# EAGLE design ESP_Uart-V2 (EAGLE 9.6.2)
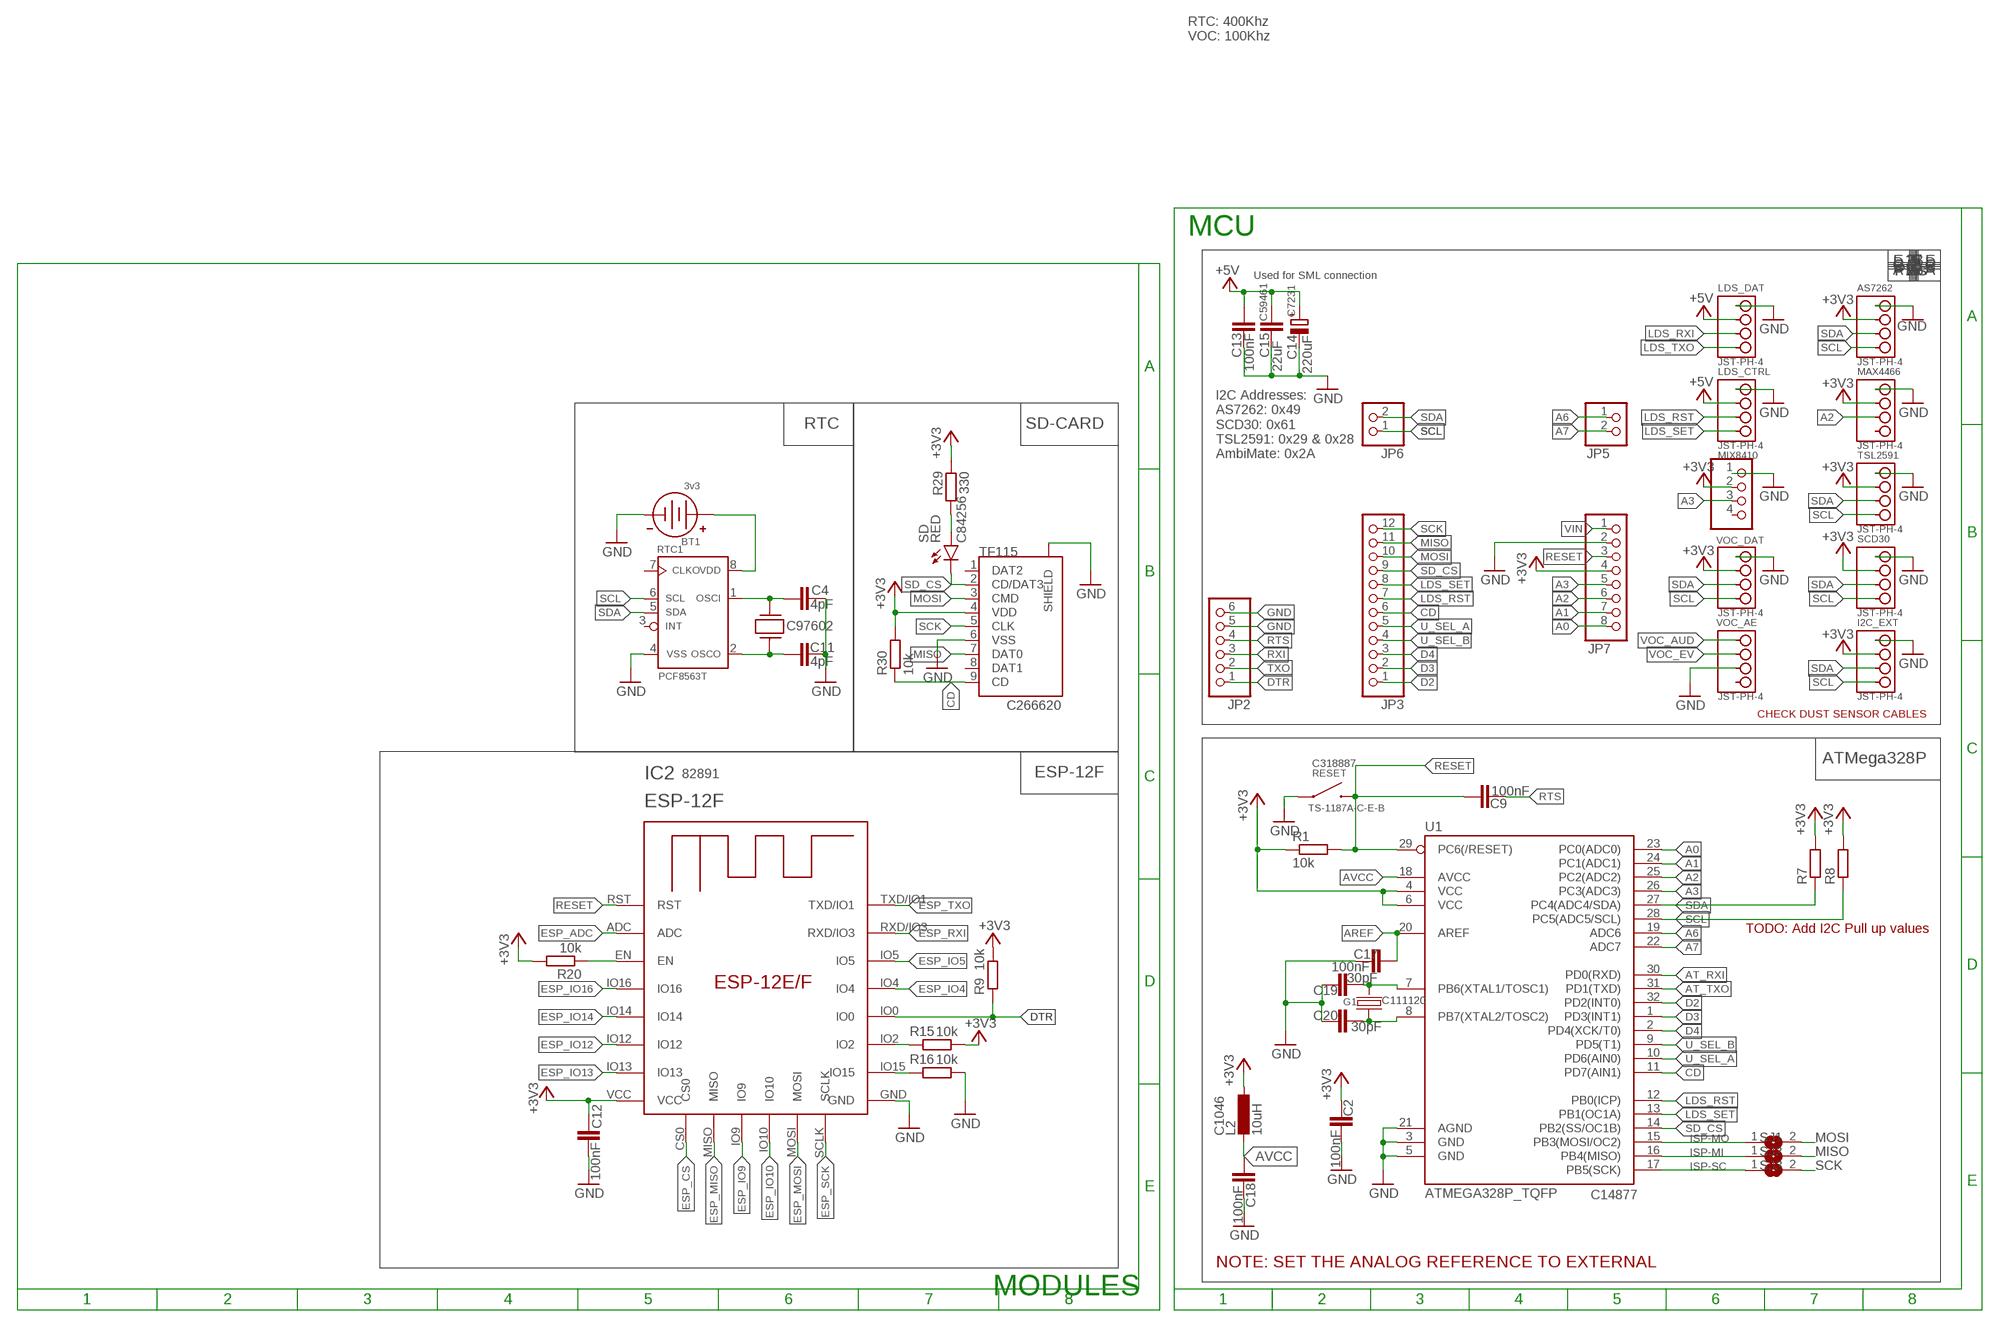
[diagram p0: schematic, sheet 1, part 1 of 2]
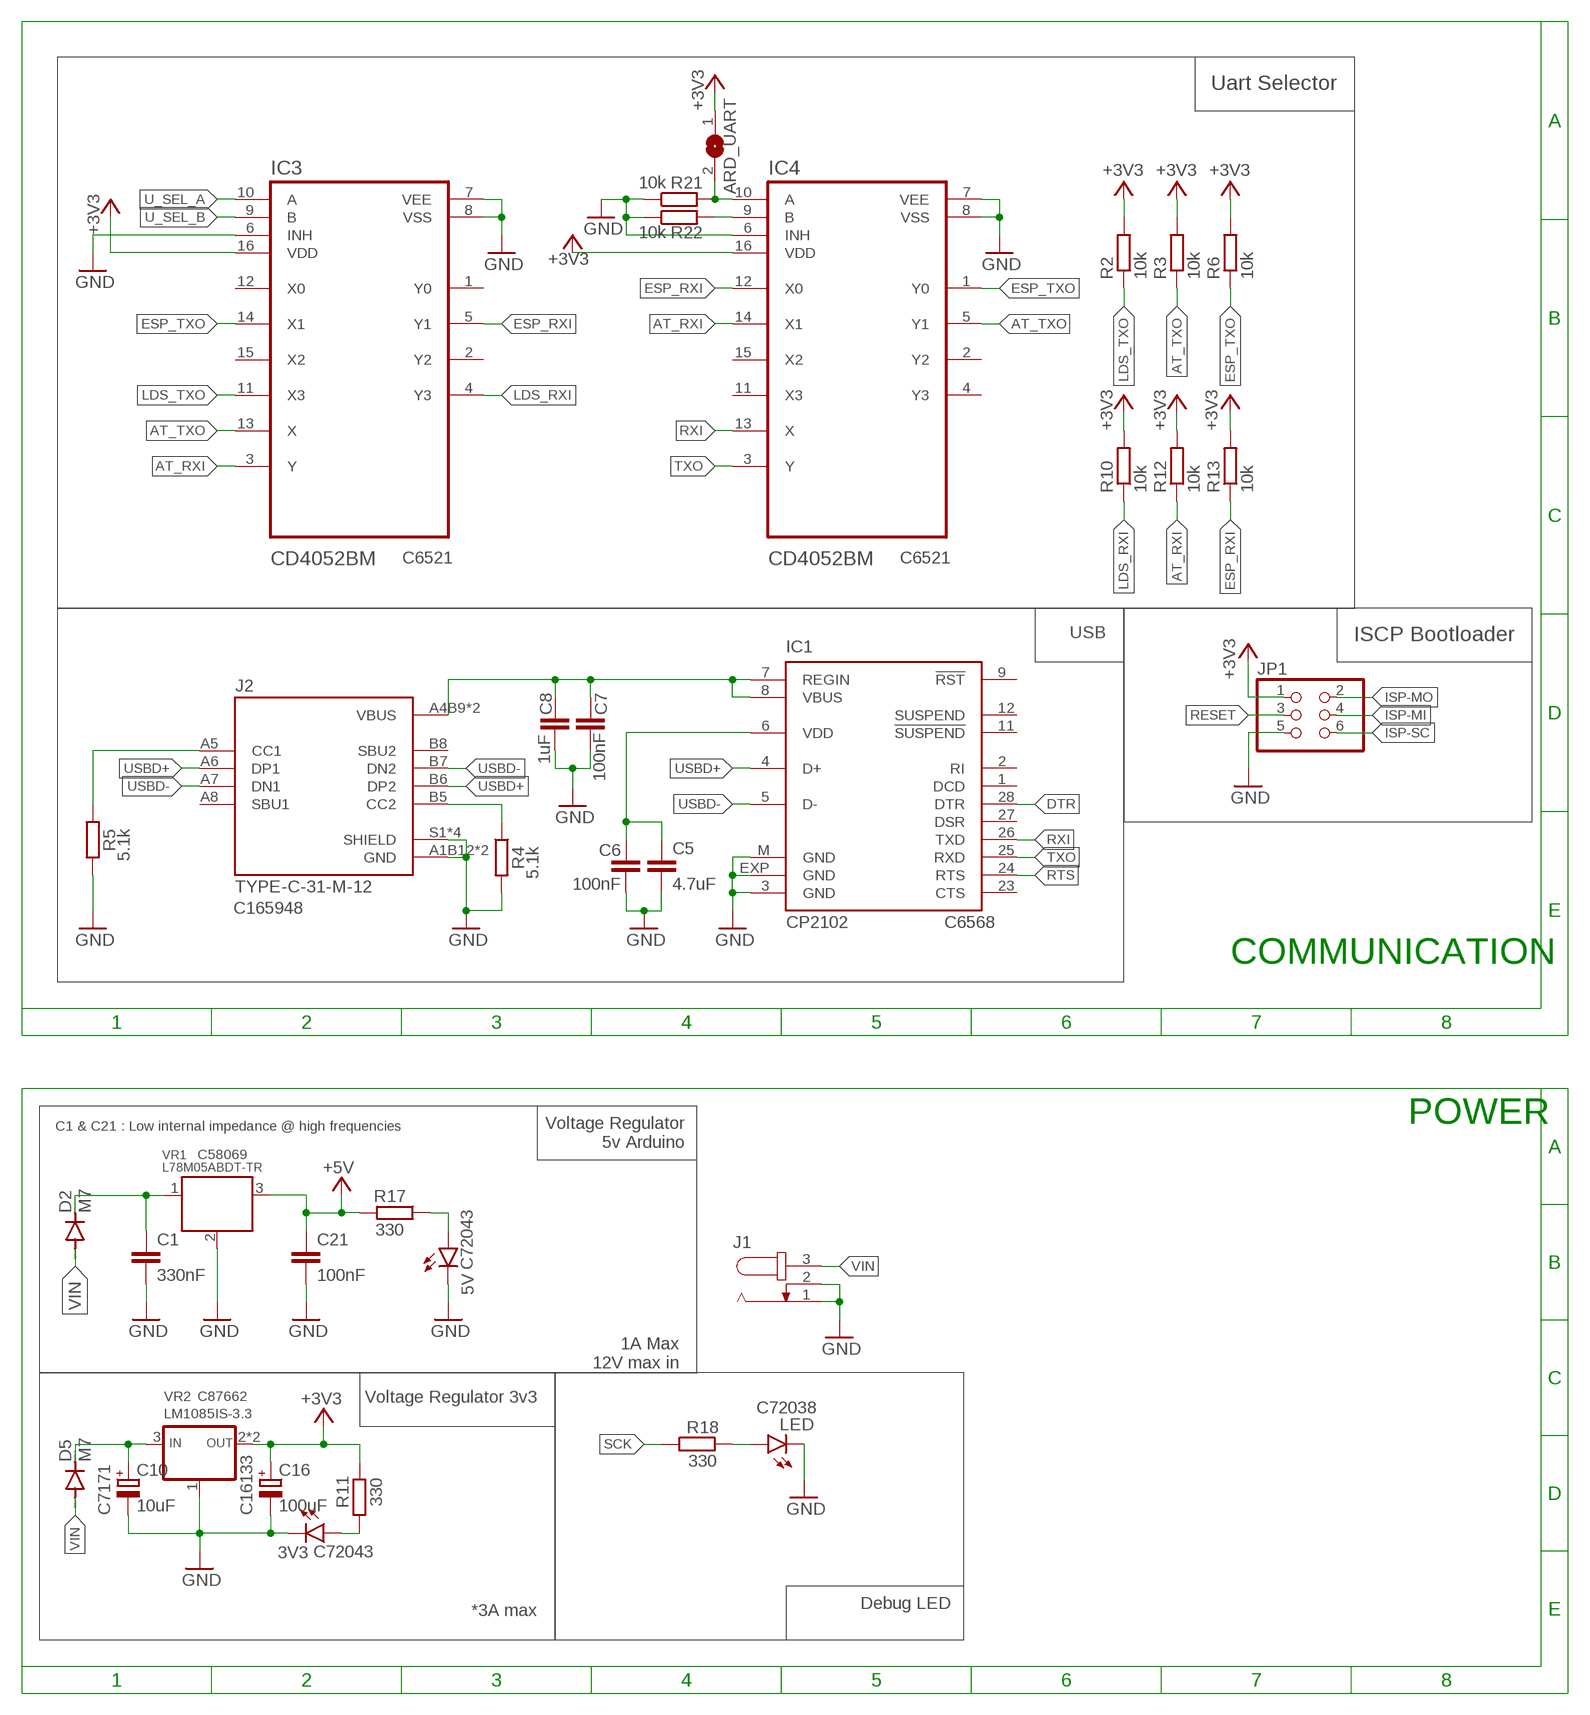
[diagram p1: schematic, sheet 1, part 2 of 2]

## Parts
3V3  C72043  LEDCHIPLED_0603  [CHIPLED_0603]
5V  C72043  LEDCHIPLED_0603  [CHIPLED_0603]
ARD_UART  SJ  [SJ]
AS7262  JST-PH-4  [JST-PH-4]
BT1  3v3  CH29-2032LF  [CH29-2032LF]
C1  330nF  C-EUC0805  [C0805]
C2  100nF  C-EUC0402  [C0402]
C4  4pF  C-EUC0402  [C0402]
C5  4.7uF  C-EUC0402  [C0402]
C6  100nF  C-EUC0402  [C0402]
C7  100nF  C-EUC0402  [C0402]
C8  1uF  C-EUC0402  [C0402]
C9  100nF  C-EUC0402  [C0402]
C10  10uF  CPOL-EUA/3216-18R  [A/3216-18R]
C11  4pF  C-EUC0402  [C0402]
C12  100nF  C-EUC0402  [C0402]
C13  100nF  C-EUC0402  [C0402]
C14  220uF  CPOL-EUA/3216-18R  [A/3216-18R]
C15  22uF  C-EUC0603  [C0603]
C16  100uF  CPOL-EUB/3528-21W  [B/3528-21W]
C17  100nF  C-EUC0402  [C0402]
C18  100nF  C-EUC0402  [C0402]
C19  30pF  C-EUC0402  [C0402]
C20  30pF  C-EUC0402  [C0402]
C21  100nF  C-EUC0402  [C0402]
D2  M7  M7DO-214AC  [DO-214AC]
D5  M7  M7DO-214AC  [DO-214AC]
G1  8Mhz  7A08000008  [7A08000008]
G2  32.768KHZ  [32.768KHZ]
I2C_EXT  JST-PH-4  [JST-PH-4]
IC1  CP2102  [MLP28]
IC2  ESP-12F  [ESP-12E]
IC3  CD4052BM  [SOIC127P600X175-16N]
IC4  CD4052BM  [SOIC127P600X175-16N]
J1  JACK-PLUG1  [SPC4078]
J2  TYPE-C-31-M-12  [HRO_TYPE-C-31-M-12]
JP1  PINHD-2X3  [2X03]
JP2  PINHD-1X6/90  [1X06/90]
JP3  PINHD-1X12  [1X12]
JP5  PINHD-1X2/90  [1X02/90]
JP6  PINHD-1X2/90  [1X02/90]
JP7  PINHD-1X8  [1X08]
L2  10uH  L-EUL2012C  [L2012C]
LDS_CTRL  JST-PH-4  [JST-PH-4]
LDS_DAT  JST-PH-4  [JST-PH-4]
LED  YELLOW  LEDCHIPLED_0603  [CHIPLED_0603]
MAX4466  JST-PH-4  [JST-PH-4]
MIX8410  PINHD-1X4  [1X04]
R1  10k  R-EU_R0402  [R0402]
R2  10k  R-EU_R0402  [R0402]
R3  10k  R-EU_R0402  [R0402]
R4  5.1k  R-EU_R0402  [R0402]
R5  5.1k  R-EU_R0402  [R0402]
R6  10k  R-EU_R0402  [R0402]
R7  R-EU_R0402  [R0402]
R8  R-EU_R0402  [R0402]
R9  10k  R-EU_R0402  [R0402]
R10  10k  R-EU_R0402  [R0402]
R11  330  R-EU_M0805  [M0805]
R12  10k  R-EU_R0402  [R0402]
R13  10k  R-EU_R0402  [R0402]
R15  10k  R-EU_R0402  [R0402]
R16  10k  R-EU_R0402  [R0402]
R17  330  R-EU_M0805  [M0805]
R18  330  R-EU_M0805  [M0805]
R20  10k  R-EU_R0402  [R0402]
R21  10k  R-EU_R0402  [R0402]
R22  10k  R-EU_R0402  [R0402]
R29  330  R-EU_R0402  [R0402]
R30  10k  R-EU_R0402  [R0402]
RESET  TS-1187A-C-E-B  [TS-1187A-C-E-B]
RTC1  PCF8563T  [SOIC8]
SCD30  JST-PH-4  [JST-PH-4]
SD  RED  LEDCHIPLED_0805  [CHIPLED_0805]
SJ1  SJ  [SJ]
SJ2  SJ  [SJ]
SJ3  SJ  [SJ]
TF115  TF-115  [TF-115]
TSL2591  JST-PH-4  [JST-PH-4]
U1  ATMEGA328P_TQFP  [TQFP32-08]
VOC_AE  JST-PH-4  [JST-PH-4]
VOC_DAT  JST-PH-4  [JST-PH-4]
VR1  L78M05ABDT-TR  [DPAK]
VR2  LM1085IS-3.3  [TO263-3]

## Nets
+3V3: ARD_UART.1 AS7262.P2 C2.2 C12.1 C16.+ I2C_EXT.P2 IC2.VCC IC3.16(VDD) IC4.16(VDD) JP1.1 JP7.4 L2.1 MAX4466.P2 MIX8410.2 R1.1 R2.2 R3.2 R6.2 R7.2 R8.2 R9.1 R10.2 R11.2 R12.2 R13.2 R15.1 R20.2 R29.2 R30.2 SCD30.P2 TF115.4(VDD) TSL2591.P2 U1.4(VCC) U1.6(VCC) VOC_DAT.P2 VR2.2(OUT) VR2.TAB(OUT)
+5V: C13.1 C14.+ C15.1 C21.1 LDS_CTRL.P2 LDS_DAT.P2 R17.2 VR1.3(VO)
A0: JP7.8 U1.23(PC0(ADC0))
A1: JP7.7 U1.24(PC1(ADC1))
A2: JP7.6 MAX4466.P3 U1.25(PC2(ADC2))
A3: JP7.5 MIX8410.3 U1.26(PC3(ADC3))
A6: JP5.1 U1.19(ADC6)
A7: JP5.2 U1.22(ADC7)
AREF: C17.1 U1.20(AREF)
AT_RXI: IC3.3(Y) IC4.14(X1) R12.1 U1.30(PD0(RXD))
AT_TXO: IC3.13(X) IC4.5(Y1) R3.1 U1.31(PD1(TXD))
AVCC: C18.2 L2.2 U1.18(AVCC)
CD: JP3.6 R30.1 TF115.9(CD) U1.11(PD7(AIN1))
D2: JP3.1 U1.32(PD2(INT0))
D3: JP3.2 U1.1(PD3(INT1))
D4: JP3.3 U1.2(PD4(XCK/T0))
DTR: IC1.28(DTR) IC2.IO0 JP2.1 R9.2
ESP_ADC: IC2.ADC
ESP_CS: IC2.CS0
ESP_EN: IC2.EN R20.1
ESP_IO4: IC2.IO4
ESP_IO5: IC2.IO5
ESP_IO9: IC2.IO9
ESP_IO10: IC2.IO10
ESP_IO12: IC2.IO12
ESP_IO13: IC2.IO13
ESP_IO14: IC2.IO14
ESP_IO16: IC2.IO16
ESP_MISO: IC2.MISO
ESP_MOSI: IC2.MOSI
ESP_RXI: IC2.RXD/IO3 IC3.5(Y1) IC4.12(X0) R13.1
ESP_SCK: IC2.SCLK
ESP_TXO: IC2.TXD/IO1 IC3.14(X1) IC4.1(Y0) R6.1
GND: 3V3.C 5V.C AS7262.P1 BT1.GND C1.2 C2.1 C4.2 C5.2 C6.2 C7.2 C8.2 C10.- C11.2 C12.2 C13.2 C14.- C15.2 C16.- C17.2 C18.1 C19.2 C20.2 C21.2 I2C_EXT.P1 IC1.3(GND) IC1.EXP(GND) IC1.M(GND) IC2.GND IC3.6(INH) IC3.7(VEE) IC3.8(VSS) IC4.6(INH) IC4.7(VEE) IC4.8(VSS) J1.1 J1.2 J2.A1B12(GND) J2.B1A12(GND) J2.S1(SHIELD) J2.S2(SHIELD) J2.S3(SHIELD) J2.S4(SHIELD) JP1.5 JP2.5 JP2.6 JP7.2 LDS_CTRL.P1 LDS_DAT.P1 LED.C MAX4466.P1 MIX8410.1 R4.2 R5.2 R16.1 R21.1 R22.1 RESET.A RESET.B(A) RTC1.4(VSS) SCD30.P1 TF115.6(VSS) TF115.10(SHIELD) TF115.11(SHIELD) TF115.12(SHIELD) TF115.13(SHIELD) TSL2591.P1 U1.3(GND) U1.5(GND) U1.21(AGND) VOC_AE.P3 VOC_DAT.P1 VR1.2(GND) VR2.1(ADJ)
ISP-MI: JP1.4 SJ2.1 U1.16(PB4(MISO))
ISP-MO: JP1.2 SJ1.1 U1.15(PB3(MOSI/OC2))
ISP-SC: JP1.6 SJ3.1 U1.17(PB5(SCK))
LDS_RST: JP3.7 LDS_CTRL.P3 U1.12(PB0(ICP))
LDS_RXI: IC3.4(Y3) LDS_DAT.P3 R10.1
LDS_SET: JP3.8 LDS_CTRL.P4 U1.13(PB1(OC1A))
LDS_TXO: IC3.11(X3) LDS_DAT.P4 R2.1
MISO: JP3.11 SJ2.2 TF115.7(DAT0)
MOSI: JP3.10 SJ1.2 TF115.3(CMD)
N$1: C4.1 G2.2 RTC1.1(OSCI)
N$2: C19.1 G1.P$1(XT1) U1.7(PB6(XTAL1/TOSC1))
N$3: BT1.VDD BT1.VDD1(VDD) RTC1.8(VDD)
N$4: 3V3.A R11.1
N$5: IC2.IO2 R15.2
N$6: C11.1 G2.1 RTC1.2(OSCO)
N$7: C1.1 D2.C VR1.1(VI)
N$8: LED.A R18.2
N$9: C20.1 G1.P$2(XT2) U1.8(PB7(XTAL2/TOSC2))
N$10: J2.B5(CC2) R4.1
N$11: J2.A5(CC1) R5.1
N$12: ARD_UART.2 IC4.10(A) R21.2
N$13: IC4.9(B) R22.2
N$14: IC2.IO15 R16.2
N$15: 5V.A R17.1
N$16: C5.1 C6.1 IC1.6(VDD)
N$19: C10.+ D5.C VR2.3(IN)
N$20: R29.1 SD.A
RESET: C9.1 IC2.RST JP1.3 JP7.3 R1.2 RESET.C RESET.D(C) U1.29(PC6(/RESET))
RTS: C9.2 IC1.24(RTS) JP2.4
RXI: IC1.26(TXD) IC4.13(X) JP2.3
SCK: JP3.12 R18.1 SJ3.2 TF115.5(CLK)
SCL: AS7262.P4 I2C_EXT.P4 JP6.1 R8.1 RTC1.6(SCL) SCD30.P4 TSL2591.P4 U1.28(PC5(ADC5/SCL)) VOC_DAT.P4
SD_CS: JP3.9 SD.C TF115.2(CD/DAT3) U1.14(PB2(SS/OC1B))
SDA: AS7262.P3 I2C_EXT.P3 JP6.2 R7.1 RTC1.5(SDA) SCD30.P3 TSL2591.P3 U1.27(PC4(ADC4/SDA)) VOC_DAT.P3
TXO: IC1.25(RXD) IC4.3(Y) JP2.2
U_SEL_A: IC3.10(A) JP3.5 U1.10(PD6(AIN0))
U_SEL_B: IC3.9(B) JP3.4 U1.9(PD5(T1))
USBD+: IC1.4(D+) J2.A6(DP1) J2.B6(DP2)
USBD-: IC1.5(D-) J2.A7(DN1) J2.B7(DN2)
VIN: D2.A D5.A J1.3 JP7.1
VOC_AUD: VOC_AE.P1
VOC_EV: VOC_AE.P2
XUSB: C7.1 C8.1 IC1.7(REGIN) IC1.8(VBUS) J2.A4B9(VBUS) J2.B4A9(VBUS)
Unconnected: IC1.1(DCD) IC1.2(RI) IC1.9(!RST) IC1.11(!SUSPEND) IC1.12(SUSPEND) IC1.23(CTS) IC1.27(DSR) IC3.1(Y0) IC3.2(Y2) IC3.12(X0) IC3.15(X2) IC4.2(Y2) IC4.4(Y3) IC4.11(X3) IC4.15(X2) J2.A8(SBU1) J2.B8(SBU2) MAX4466.P4 MIX8410.4 RTC1.3(/INT) RTC1.7(CLKO) TF115.1(DAT2) TF115.8(DAT1) VOC_AE.P4

## Notes on the sheet
- RTC: 400Khz
  VOC: 100Khz
- Uart Selector
- MCU
- Pins
- Used for SML connection
- RTC | SD-CARD
- I2C Addresses:
  AS7262: 0x49
  SCD30: 0x61
  TSL2591: 0x29 & 0x28
  AmbiMate: 0x2A
- USB | ISCP Bootloader
- CHECK DUST SENSOR CABLES
- ATMega328P | COMMUNICATION
- ESP-12F
- Voltage Regulator
  5v Arduino
- POWER
- C1 & C21 : Low internal impedance @ high frequencies
- TODO: Add I2C Pull up values
- 1A Max
  12V max in
- Voltage Regulator 3v3
- Debug LED
- *3A max
- NOTE: SET THE ANALOG REFERENCE TO EXTERNAL
- MODULES

## Library data of the parts
3V3 5V = led:LED: LED OSRAM: - CHIPLED LG R971, LG N971, LY N971, LG Q971, LY Q971, LO R971, LY R971 LH N974, LH R974 LS Q976, LO Q976, LY Q976 LO Q996 - Hyper CHIPLED LW Q18S LB Q993, LB Q99A, LB R99A - SideLED LS A670, LO A670, LY A670, LG A670, LP A670 LB A673, LV A673, LT A673, LW A673 LH A674 LY A675 LS A676, LA A676, LO A676, LY A676, LW A676 LS A679, LY A679, LG A679 - Hyper Micro SIDELED® LS Y876, LA Y876, LO Y876, LY Y876 LT Y87S - SmartLED LW L88C, LW L88S LB L89C, LB L89S, LG L890 LS L89K, LO L89K, LY L89K LS L896, LA L896, LO L896, LY L896 - TOPLED LS T670, LO T670, LY T670, LG T670, LP T670 LSG T670, LSP T670, LSY T670, LOP T670, LYG T670 LG T671, LOG T671, LSG T671 LB T673, LV T673, LT T673, LW T673 LH T674 LS T676, LA T676, LO T676, LY T676, LB T676, LH T676, LSB T676, LW T676 LB T67C, LV T67C, LT T67C, LS T67K, LO T67K, LY T67K, LW E67C LS E67B, LA E67B, LO E67B, LY E67B, LB E67C, LV E67C, LT E67C LW T67C LS T679, LY T679, LG T679 LS T770, LO T770, LY T770, LG T770, LP T770 LB T773, LV T773, LT T773, LW T773 LH T774 LS E675, LA E675, LY E675, LS T675 LS T776, LA T776, LO T776, LY T776, LB T776 LHGB T686 LT T68C, LB T68C - Hyper Mini TOPLED® LB M676 - Mini TOPLED Santana® LG M470 LS M47K, LO M47K, LY M47K Source: http://www.osram.convergy.de LUXEON: - LUMILED® LXK2-PW12-R00, LXK2-PW12-S00, LXK2-PW14-U00, LXK2-PW14-V00 LXK2-PM12-R00, LXK2-PM12-S00, LXK2-PM14-U00 LXK2-PE12-Q00, LXK2-PE12-R00, LXK2-PE12-S00, LXK2-PE14-T00, LXK2-PE14-U00 LXK2-PB12-K00, LXK2-PB12-L00, LXK2-PB12-M00, LXK2-PB14-N00, LXK2-PB14-P00, LXK2-PB14-Q00 LXK2-PR12-L00, LXK2-PR12-M00, LXK2-PR14-Q00, LXK2-PR14-R00 LXK2-PD12-Q00, LXK2-PD12-R00, LXK2-PD12-S00 LXK2-PH12-R00, LXK2-PH12-S00 LXK2-PL12-P00, LXK2-PL12-Q00, LXK2-PL12-R00 Source: www.luxeon.com KINGBRIGHT: KA-3528ASYC Source: www.kingbright.com; PTNR: C72043
ARD_UART SJ1-SJ3 = Tilmann:SJ: SMD solder JUMPER
AS7262 I2C_EXT LDS_CTRL LDS_DAT MAX4466 SCD30 TSL2591 VOC_AE VOC_DAT = Tilmann:JST-PH-4: 4 pin PH JST connector Partnr: C50137 Datasheet: Link <https://datasheet.lcsc.com/lcsc/2010211204_BOOMELE-Boom-Precision-Elec-C50137_C50137.pdf>; PTRNR: C50137
BT1 = Tilmann:CH29-2032LF: CH29-203LLF 20mm 3v Battery holder Footprint: PTH Stock: Farnell <https://nl.farnell.com/multicomp/ch29-2032lf/battery-holder-dip-20mm/dp/2064726> Datasheet: Link <https://www.farnell.com/datasheets/1505864.pdf>
C1 C2 C4-C9 C11-C13 C17-C21 = rcl:C-EU: CAPACITOR, European symbol; SPICEPREFIX: C
C10 = rcl:CPOL-EU: POLARIZED CAPACITOR, European symbol; PTRNR: C7171; SPICEPREFIX: C
C14 = rcl:CPOL-EU: POLARIZED CAPACITOR, European symbol; PTRNR: C7231; SPICEPREFIX: C
C15 = rcl:C-EU: CAPACITOR, European symbol; PTRNR: C59461; SPICEPREFIX: C
C16 = rcl:CPOL-EU: POLARIZED CAPACITOR, European symbol; PTRNR: C16133; SPICEPREFIX: C
D2 D5 = Tilmann:M7: DIODE M7 Diode Footprint: SMA Partnr: C95872 Datasheet: Link <https://datasheet.lcsc.com/lcsc/1810311713_MDD%EF%BC%88Microdiode-Electronics%EF%BC%89-M7_C95872.pdf>; PTNR: C95872
G1 = Tilmann:7A08000008: 7A08000008 Crystal resonator Partnr: C111120 Frequency: 8mhz Datasheet: Link <https://datasheet.lcsc.com/lcsc/1811101510_TXC-Corp-7A08000008_C111120.pdf> Note: two 30pf Capacitors needed; PTRNR: C111120
G2 = Tilmann:32.768KHZ: SC-20S Crystal resonator Partnr: C97602 Freq: 32768Hz Datasheet: Link <https://datasheet.lcsc.com/lcsc/1811151451_Seiko-SC-20S,32.768kHz,20PPM,7pF_C97602.pdf> Note: needs two 4pf capacitors; PTRNR: C97602
IC1 = Tilmann:CP210*: Single-Chip USB to UART Bridge USB to UART converter Partnr: C6568 Datasheet: Link <https://datasheet.lcsc.com/lcsc/1811081920_SILICON-LABS-CP2102-GMR_C6568.pdf>; MF: FARNELL; MPN: CP2102-GM; OC_FARNELL: 9282130; OC_NEWARK: 30K5635; PTRNR: C6568
IC2 = Tilmann:ESP-12: ESP-12F SMD wifi module Partnr: C82891 Datasheet: Link <https://docs.ai-thinker.com/_media/esp8266/docs/esp-12f_product_specification_en.pdf> Documentation: Link <https://arduino-esp8266.readthedocs.io/en/3.0.2/>; PTRNR: 82891
IC3 IC4 = Tilmann:CD4052BM: CDE4052BM single 8 channel analog multiplexer / demultiplexer Partnr: C6521 Footprint: SO16 datasheet: Link <https://www.ti.com/lit/ds/symlink/cd4052b.pdf?ts=1634656882290&ref_url=https%253A%252F%252Fwww.ti.com%252Fstore%252Fti%252Fen%252Fp%252Fproduct%252F%253Fp%253DCD4052BM> Check prices <https://pricing.snapeda.com/parts/CD4052BM/Texas%20Instruments/view-part?ref=eda>; AVAILABILITY: In Stock; DESCRIPTION: 20-V, 4:1, 2-channel general-purpose multiplexer 16-SOIC -55 to 125; MF: Texas Instruments; MP: CD4052BM; PACKAGE: SOIC-16 Texas Instruments; PRICE: None; PTNR: C6521; PTRNR: C6521; PURCHASE-URL: https://pricing.snapeda.com/search/part/CD4052BM/?ref=eda
J1 = Tilmann:JACK-PLUG: DC POWER JACK Power Jack, DC, Right Angle, Through Hole, Rated 5A at 16VDC, PC Terminals Distributor: Farnell (www.Farnell.de) Drawing: 84N1161.pdf / 84N1162.pdf Manufacturer: SPC Technology (www.spctechnology.com) Type: SPC4077 / SPC 4078; OC_FARNELL: unknown; OC_NEWARK: unknown
J2 = Tilmann:TYPE-C-31-M-12: TYPE-C-31-M-12 SMD USB-C connector Partnr: C165948 Footprint: TYPE-C-31_L8.94-W7.3 Datasheet: Link <https://datasheet.lcsc.com/lcsc/1811131825_Korean-Hroparts-Elec-TYPE-C-31-M-12_C165948.pdf>; AVAILABILITY: No availability data; DESCRIPTION: USB Connectors 24 Receptacle 1 8.94*7.3mm RoHS; MF: HRO Electronics Co., Ltd.; MP: TYPE-C-31-M-12; PACKAGE: Package; PRICE: None; PTRNR: C165948
JP1 = Tilmann:PINHD-2X3: PIN HEADER
JP2 = Tilmann:PINHD-1X6: PIN HEADER
JP3 = Tilmann:PINHD-1X12: PIN HEADER
JP5 JP6 = Tilmann:PINHD-1X2: PIN HEADER
JP7 = Tilmann:PINHD-1X8: PIN HEADER
L2 = rcl:L-EU: INDUCTOR, European symbol; PRTNR: C1046; SPICEPREFIX: L
LED = led:LED: LED OSRAM: - CHIPLED LG R971, LG N971, LY N971, LG Q971, LY Q971, LO R971, LY R971 LH N974, LH R974 LS Q976, LO Q976, LY Q976 LO Q996 - Hyper CHIPLED LW Q18S LB Q993, LB Q99A, LB R99A - SideLED LS A670, LO A670, LY A670, LG A670, LP A670 LB A673, LV A673, LT A673, LW A673 LH A674 LY A675 LS A676, LA A676, LO A676, LY A676, LW A676 LS A679, LY A679, LG A679 - Hyper Micro SIDELED® LS Y876, LA Y876, LO Y876, LY Y876 LT Y87S - SmartLED LW L88C, LW L88S LB L89C, LB L89S, LG L890 LS L89K, LO L89K, LY L89K LS L896, LA L896, LO L896, LY L896 - TOPLED LS T670, LO T670, LY T670, LG T670, LP T670 LSG T670, LSP T670, LSY T670, LOP T670, LYG T670 LG T671, LOG T671, LSG T671 LB T673, LV T673, LT T673, LW T673 LH T674 LS T676, LA T676, LO T676, LY T676, LB T676, LH T676, LSB T676, LW T676 LB T67C, LV T67C, LT T67C, LS T67K, LO T67K, LY T67K, LW E67C LS E67B, LA E67B, LO E67B, LY E67B, LB E67C, LV E67C, LT E67C LW T67C LS T679, LY T679, LG T679 LS T770, LO T770, LY T770, LG T770, LP T770 LB T773, LV T773, LT T773, LW T773 LH T774 LS E675, LA E675, LY E675, LS T675 LS T776, LA T776, LO T776, LY T776, LB T776 LHGB T686 LT T68C, LB T68C - Hyper Mini TOPLED® LB M676 - Mini TOPLED Santana® LG M470 LS M47K, LO M47K, LY M47K Source: http://www.osram.convergy.de LUXEON: - LUMILED® LXK2-PW12-R00, LXK2-PW12-S00, LXK2-PW14-U00, LXK2-PW14-V00 LXK2-PM12-R00, LXK2-PM12-S00, LXK2-PM14-U00 LXK2-PE12-Q00, LXK2-PE12-R00, LXK2-PE12-S00, LXK2-PE14-T00, LXK2-PE14-U00 LXK2-PB12-K00, LXK2-PB12-L00, LXK2-PB12-M00, LXK2-PB14-N00, LXK2-PB14-P00, LXK2-PB14-Q00 LXK2-PR12-L00, LXK2-PR12-M00, LXK2-PR14-Q00, LXK2-PR14-R00 LXK2-PD12-Q00, LXK2-PD12-R00, LXK2-PD12-S00 LXK2-PH12-R00, LXK2-PH12-S00 LXK2-PL12-P00, LXK2-PL12-Q00, LXK2-PL12-R00 Source: www.luxeon.com KINGBRIGHT: KA-3528ASYC Source: www.kingbright.com; PTRNR: C72038
MIX8410 = Tilmann:PINHD-1X4: PIN HEADER
R1-R13 R15-R18 R20-R22 R29 R30 = rcl:R-EU_: RESISTOR, European symbol; SPICEPREFIX: R
RESET = Tilmann:TS-1187A-C-E-B: TS-1187A-C-E-B SMD Top actuated 50mA @ 12V Round button Partnr: C318887 Footprint: SMD-SW-4_5.1x5.1x2.5 Datasheet: Link <https://datasheet.lcsc.com/lcsc/2002271432_XKB-Connectivity-TS-1187A-C-E-B_C318887.pdf>; PRTNR: C318887
RTC1 = Tilmann:PCF8563: PCF8563 SMD RTC Module I2C, YY-MM-DD-dd HH:MM:SS (24hr) Footprint: SOIC8 Partnr: C7440 Datasheet: Link <https://datasheet.lcsc.com/lcsc/1809141212_NXP-Semicon-PCF8563T-5,518_C7440.pdf>; PTNR: C7440
SD = led:LED: LED OSRAM: - CHIPLED LG R971, LG N971, LY N971, LG Q971, LY Q971, LO R971, LY R971 LH N974, LH R974 LS Q976, LO Q976, LY Q976 LO Q996 - Hyper CHIPLED LW Q18S LB Q993, LB Q99A, LB R99A - SideLED LS A670, LO A670, LY A670, LG A670, LP A670 LB A673, LV A673, LT A673, LW A673 LH A674 LY A675 LS A676, LA A676, LO A676, LY A676, LW A676 LS A679, LY A679, LG A679 - Hyper Micro SIDELED® LS Y876, LA Y876, LO Y876, LY Y876 LT Y87S - SmartLED LW L88C, LW L88S LB L89C, LB L89S, LG L890 LS L89K, LO L89K, LY L89K LS L896, LA L896, LO L896, LY L896 - TOPLED LS T670, LO T670, LY T670, LG T670, LP T670 LSG T670, LSP T670, LSY T670, LOP T670, LYG T670 LG T671, LOG T671, LSG T671 LB T673, LV T673, LT T673, LW T673 LH T674 LS T676, LA T676, LO T676, LY T676, LB T676, LH T676, LSB T676, LW T676 LB T67C, LV T67C, LT T67C, LS T67K, LO T67K, LY T67K, LW E67C LS E67B, LA E67B, LO E67B, LY E67B, LB E67C, LV E67C, LT E67C LW T67C LS T679, LY T679, LG T679 LS T770, LO T770, LY T770, LG T770, LP T770 LB T773, LV T773, LT T773, LW T773 LH T774 LS E675, LA E675, LY E675, LS T675 LS T776, LA T776, LO T776, LY T776, LB T776 LHGB T686 LT T68C, LB T68C - Hyper Mini TOPLED® LB M676 - Mini TOPLED Santana® LG M470 LS M47K, LO M47K, LY M47K Source: http://www.osram.convergy.de LUXEON: - LUMILED® LXK2-PW12-R00, LXK2-PW12-S00, LXK2-PW14-U00, LXK2-PW14-V00 LXK2-PM12-R00, LXK2-PM12-S00, LXK2-PM14-U00 LXK2-PE12-Q00, LXK2-PE12-R00, LXK2-PE12-S00, LXK2-PE14-T00, LXK2-PE14-U00 LXK2-PB12-K00, LXK2-PB12-L00, LXK2-PB12-M00, LXK2-PB14-N00, LXK2-PB14-P00, LXK2-PB14-Q00 LXK2-PR12-L00, LXK2-PR12-M00, LXK2-PR14-Q00, LXK2-PR14-R00 LXK2-PD12-Q00, LXK2-PD12-R00, LXK2-PD12-S00 LXK2-PH12-R00, LXK2-PH12-S00 LXK2-PL12-P00, LXK2-PL12-Q00, LXK2-PL12-R00 Source: www.luxeon.com KINGBRIGHT: KA-3528ASYC Source: www.kingbright.com; PTRNR: C84256
TF115 = Tilmann:TF-115: TF-115 SMD SD card holder Footprint: TF-115 Partnr: C266620 Datasheet: Link <https://datasheet.lcsc.com/lcsc/2105061832_XUNPU-TF-115_C266620.pdf>; PTNR: C266620; PTRNR: C266620
U1 = Tilmann:ATMEGA328P_TQFP: Popular 328P in QFP Storefront component: ATmega328 - TQFP <https://www.sparkfun.com/products/13448> (COM-13448) Datasheet <http://www.sparkfun.com/datasheets/Components/SMD/ATMega328.pdf> Ptrnr: C14877; PROD_ID: IC-09069; PTNR: C14877; PTRNR: C14877
VR1 = Tilmann:L78M05ABDT-TR: L78M05ABDT-TR 5V @ 500mA Max 2V dropout Partnr: C58069 Footprint: DPAK Datasheet: Link <https://datasheet.lcsc.com/lcsc/1811011937_STMicroelectronics-L78M05ABDT-TR_C58069.pdf>; PTRNR: C58069
VR2 = Tilmann:LM1085IS-3.3: LM1085 3v3 @ 3A regulator Max 1.5V drop out Partnr: C87662 Footprint: TO263-3 Datasheet: Link <https://datasheet.lcsc.com/lcsc/1810151518_Texas-Instruments-LM1085IS-3.3-NOPB_C87662.pdf>; PTRNR: C87662

## Board
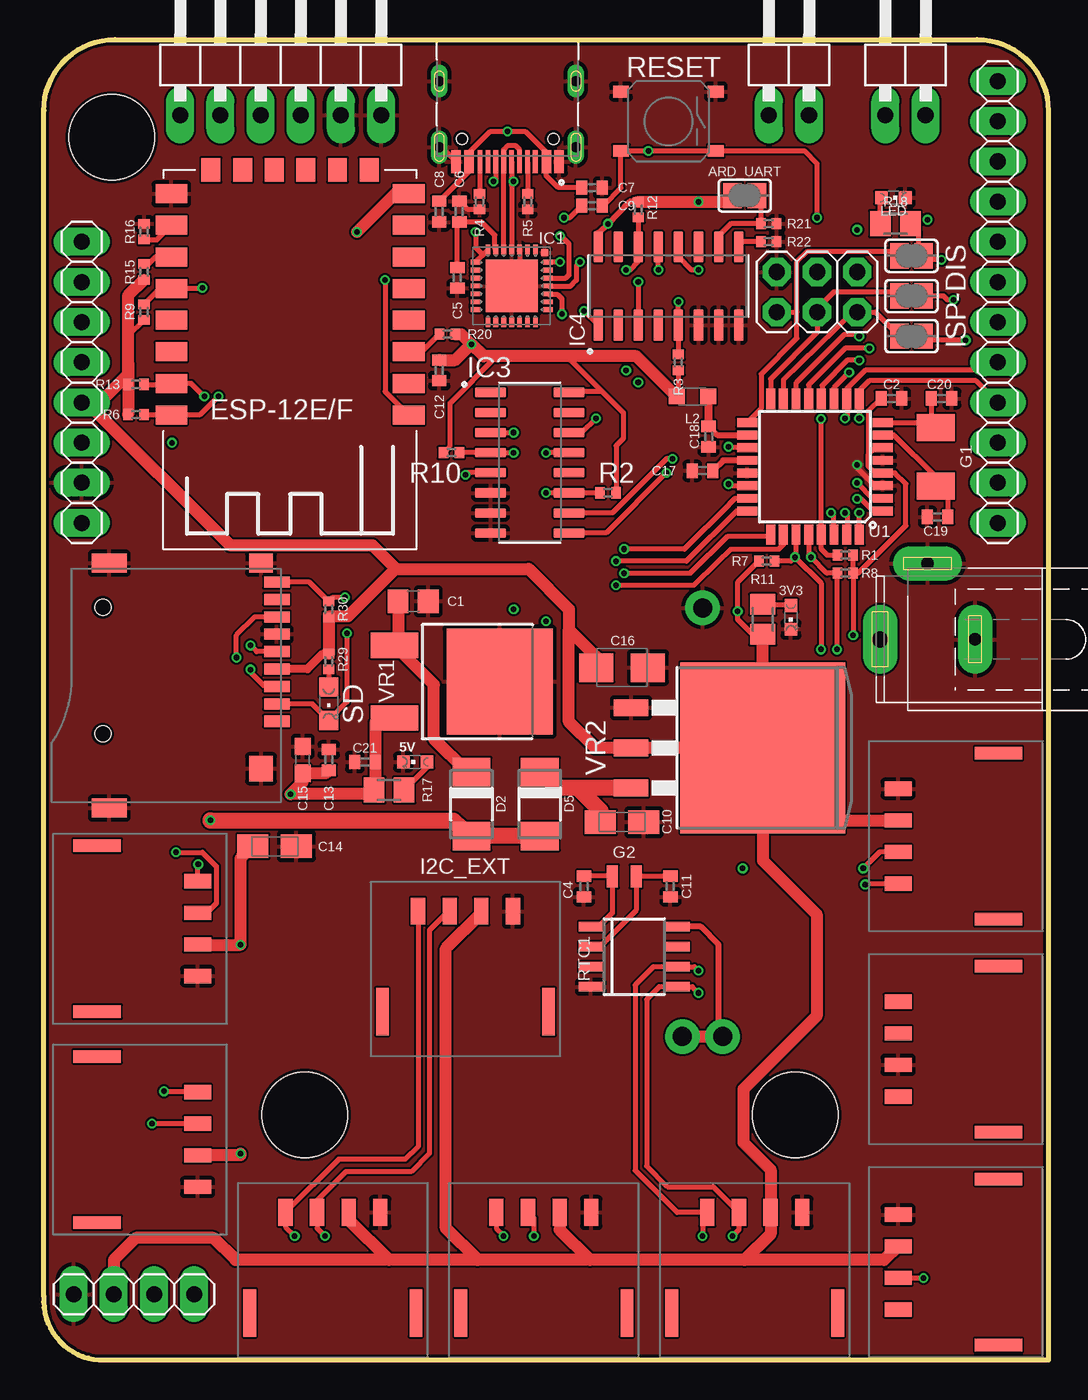
[diagram p2: board, top side]
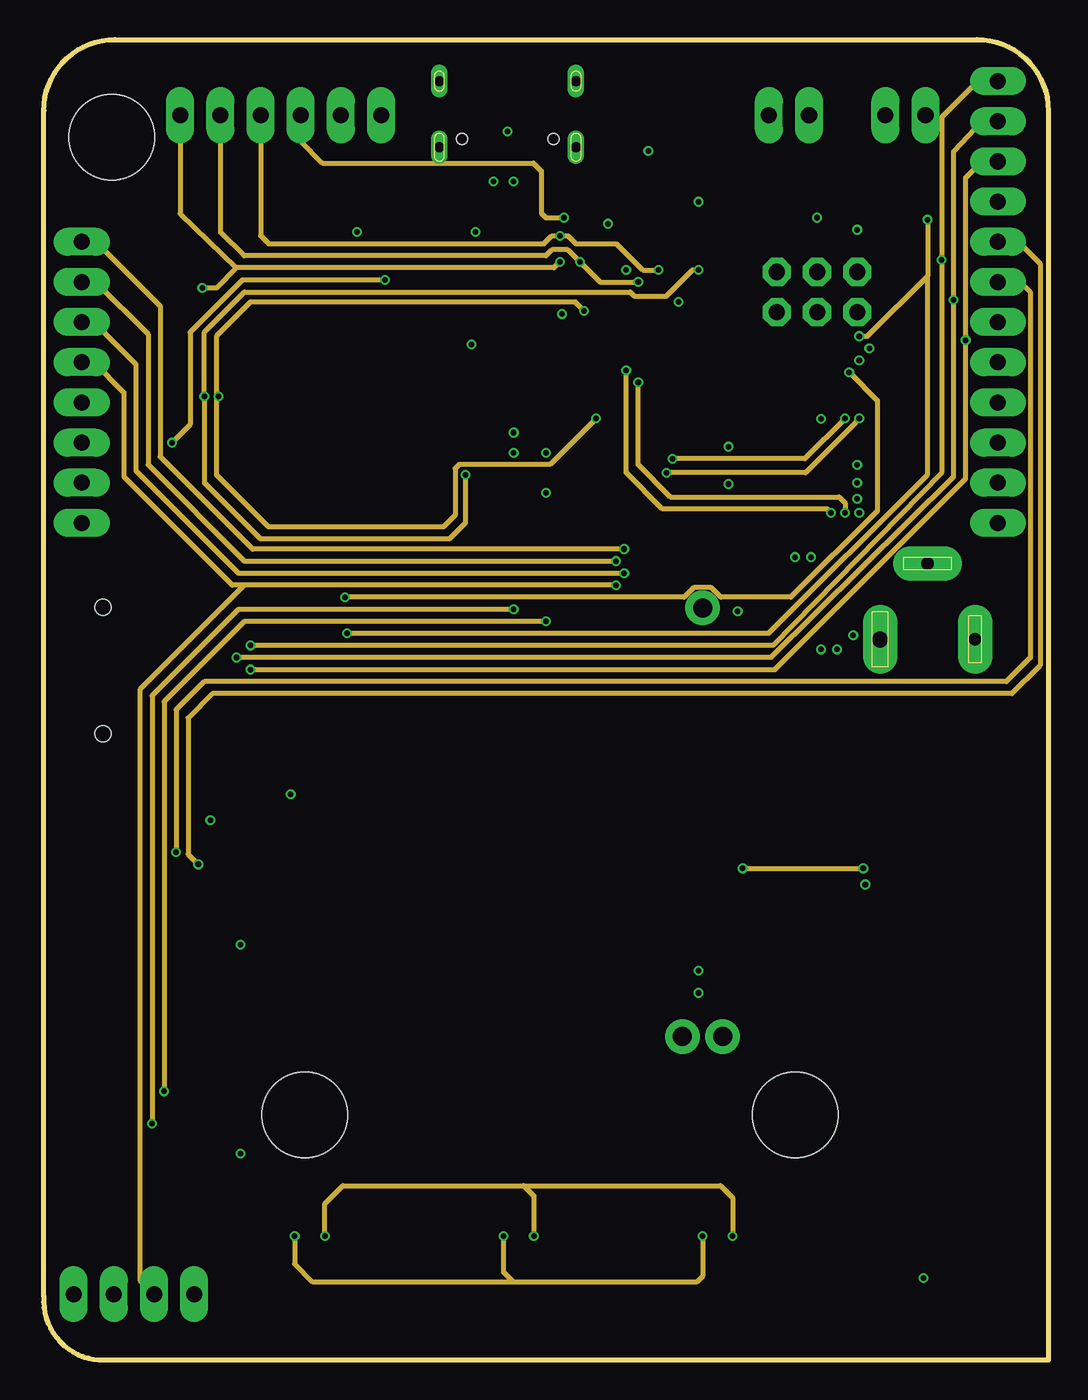
[diagram p3: board, inner layer Route2]
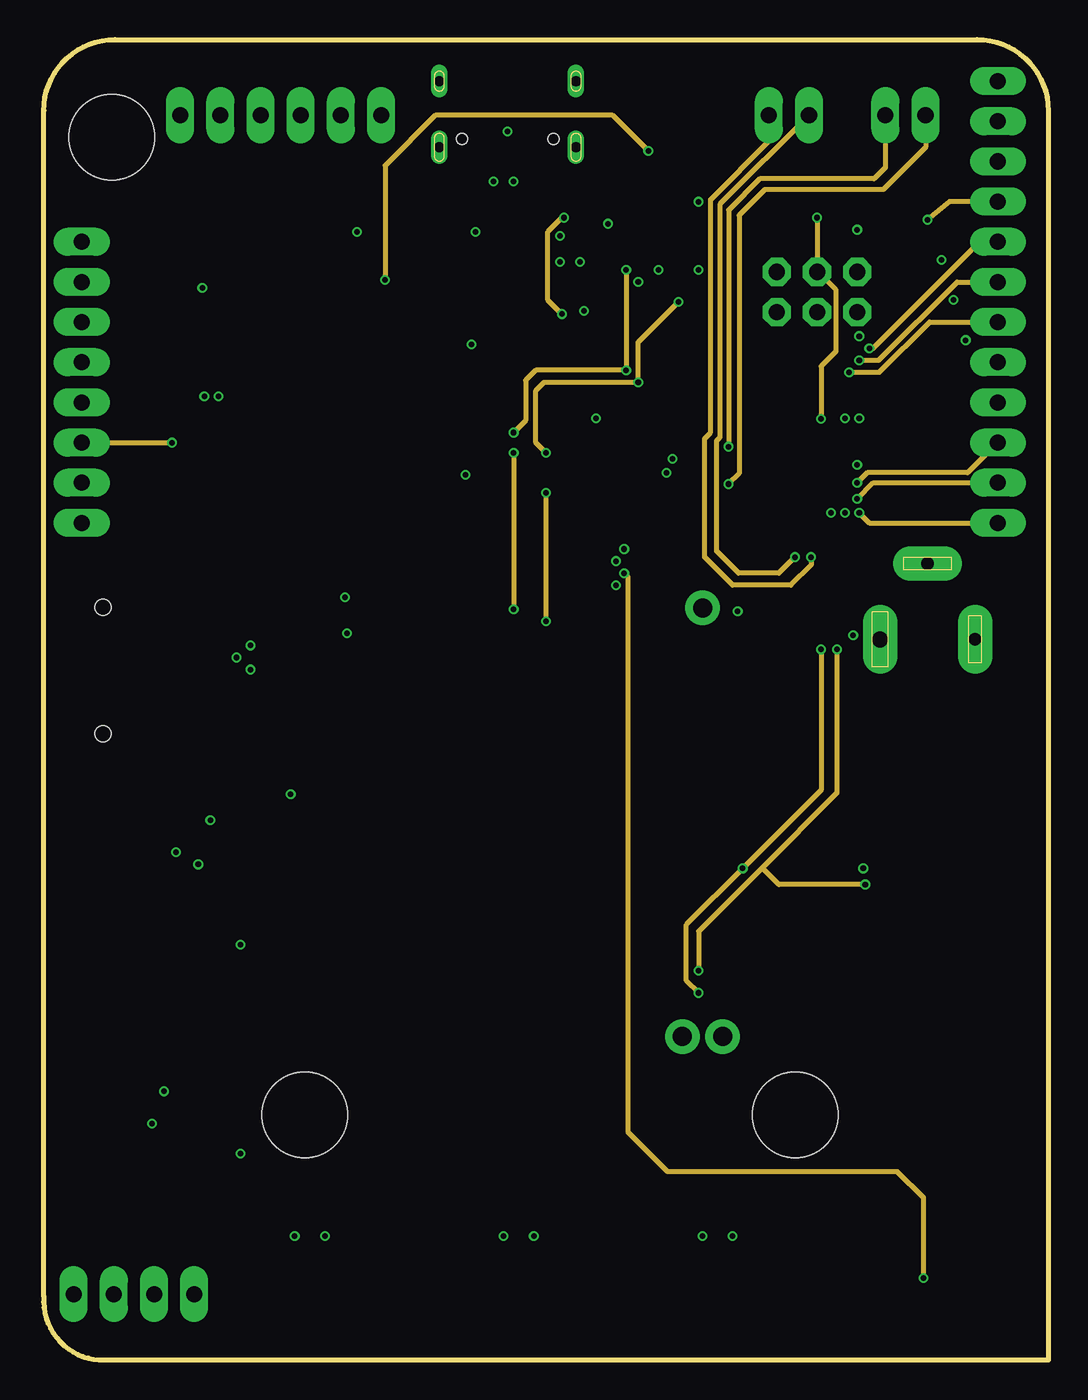
[diagram p4: board, inner layer Route15]
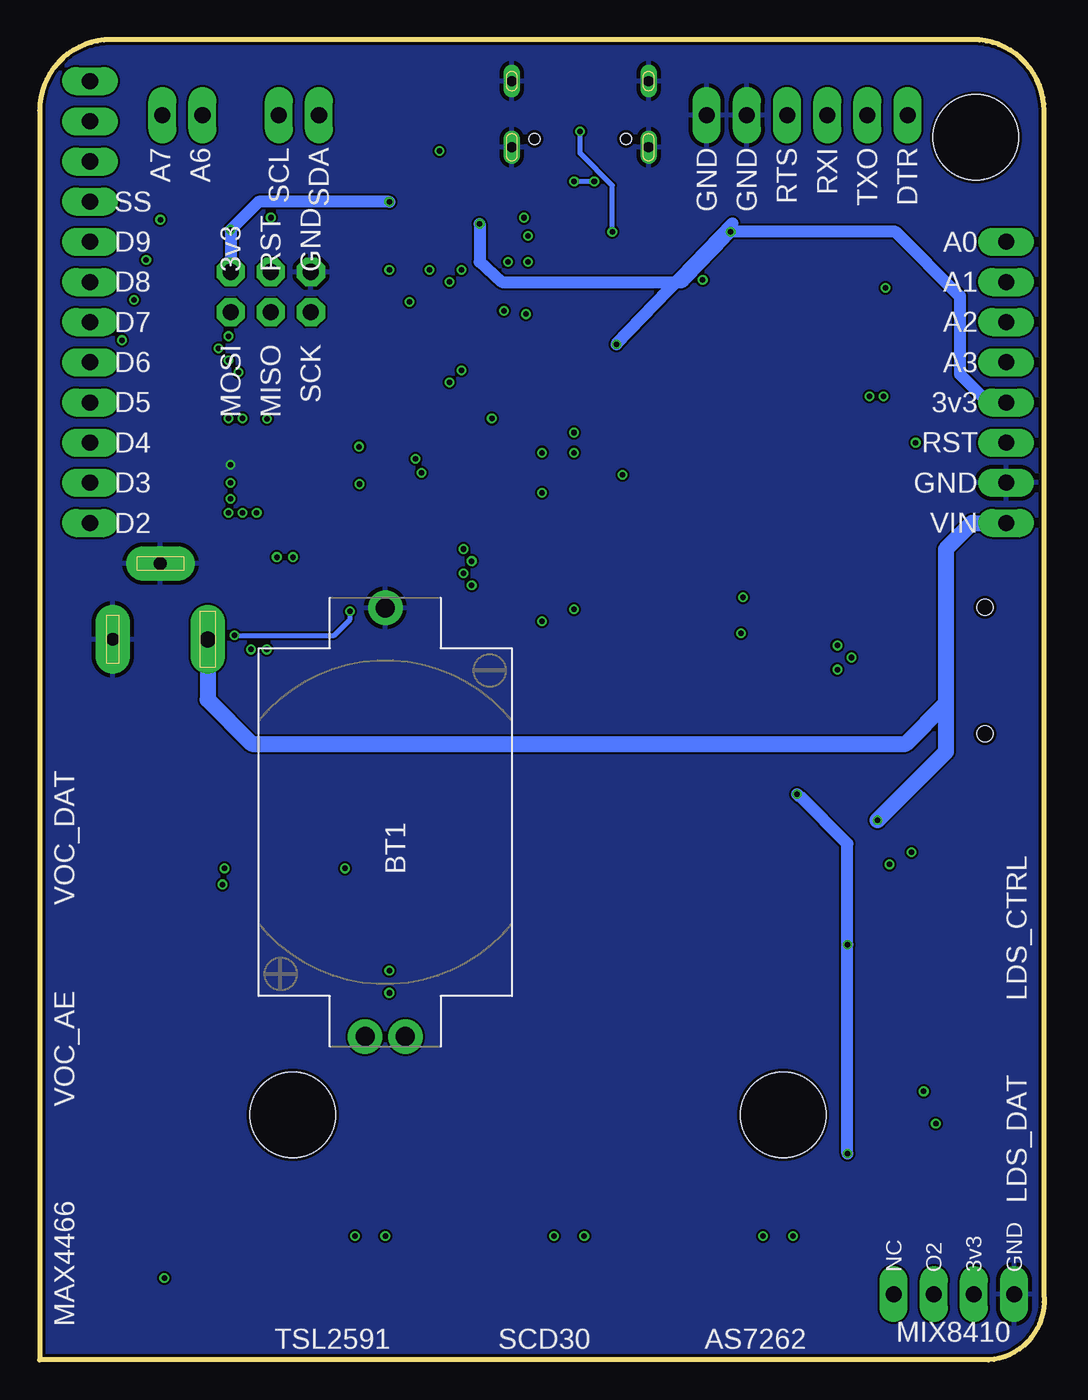
[diagram p5: board, bottom side, seen from below]

Size 63.51 x 83.5 mm. Coordinates in mm from the lower left corner, seen from the top.
Outline: 4.51,83.5 59.01,83.5 arc-90 63.51,79 63.51,0 3.51,0 arc-90 0.01,4 0.01,79 arc-90 4.51,83.5
Copper layers (1+2*15+16): Top 0.035mm / dielectric 0.2mm / Route2 0.0175mm / dielectric 1.065mm / Route15 0.0175mm / dielectric 0.2mm / Bottom 0.035mm
Design rules "jlcpcb-4layers *": minimum track width 5mil, minimum drill 0.2mm, track to track 5mil, track to pad 5mil, pad to pad 5mil, via to via 5mil, smd to smd 5mil, copper to edge 0.2mm, drill to drill 6mil, minimum pad ring 0.15mm, minimum via ring 0.13mm, stop-mask expansion 4mil, vias tented up to drill 0mil, thermal gap 10mil
Holes 5.4 mm at 4.31,77.31 16.51,15.5 47.51,15.5

### Footprints (pad centres in the part's own frame; a part is rotated, then mirrored left to right if it is on the bottom)
CHIPLED_0603 = smd 0.8 x 0.8: A 0,-0.75; C 0,0.75
SJ = smd 1.168 x 1.6: 1 -0.762,0; 2 0.762,0
JST-PH-4 = smd 0.9 x 1.7: P1 -3,-4.15; P2 -1,-4.15; P3 1,-4.15; P4 3,-4.15 | smd 0.8 x 3: SHIELD -5.25,2.2; SHIELD1 5.25,2.2
CH29-2032LF = drill 1.2 pad 2.184: GND -13.55,0; VDD 13.55,-1.27; VDD1 13.55,1.27
C0805 = smd 1.3 x 1.5: 1 -0.95,0; 2 0.95,0
C0402 = smd 0.7 x 0.9: 1 -0.65,0; 2 0.65,0
A/3216-18R = smd 1.95 x 1.5: + 1.375,0; - -1.375,0
C0603 = smd 1.1 x 1: 1 -0.85,0; 2 0.85,0
B/3528-21W = smd 2.15 x 1.8: + 1.625,0; - -1.625,0
DO-214AC = smd 1.8 x 2.4: A 2.025,0; C -2.025,0
7A08000008 = smd 1.7 x 2.4: P$1 -1.85,0; P$2 1.85,0
32.768KHZ = smd 0.7 x 1.4: 1 -0.75,0; 2 0.75,0
MLP28 = smd 0.6 x 0.3: 1 -2.3,1.5; 2 -2.3,1; 3 -2.3,0.5; 4 -2.3,0; 5 -2.3,-0.5; 6 -2.3,-1; 7 -2.3,-1.5; 15 2.3,-1.5; 16 2.3,-1; 17 2.3,-0.5; 18 2.3,0; 19 2.3,0.5; 20 2.3,1; 21 2.3,1.5 | smd 0.3 x 0.6: 8 -1.5,-2.3; 9 -1,-2.3; 10 -0.5,-2.3; 11 0,-2.3; 12 0.5,-2.3; 13 1,-2.3; 14 1.5,-2.3; 22 1.5,2.3; 23 1,2.3; 24 0.5,2.3; 25 0,2.3; 26 -0.5,2.3; 27 -1,2.3; 28 -1.5,2.3 | smd 3.3 x 3.3: EXP 0,0 | smd 0.435 x 0.435: M -2.103,2.103
ESP-12E = smd 2 x 1.2: ADC -7.46,5.53; EN -7.46,3.53; GND 7.54,-6.47; IO0 7.54,-0.47; IO2 7.54,-2.47; IO4 7.54,1.53; IO5 7.54,3.53; IO12 -7.46,-2.47; IO13 -7.46,-4.47; IO14 -7.46,-0.47; IO15 7.54,-4.47; IO16 -7.46,1.53; RST -7.46,7.53; RXD/IO3 7.54,5.53; TXD/IO1 7.54,7.53; VCC -7.46,-6.47 | smd 1.2 x 1.5: CS0 -4.96,-7.97; IO9 -0.96,-7.97; IO10 1.04,-7.97; MISO -2.96,-7.97; MOSI 3.04,-7.97; SCLK 5.04,-7.97
SOIC127P600X175-16N = smd 1.97 x 0.6: 1 -2.475,4.445; 2 -2.475,3.175; 3 -2.475,1.905; 4 -2.475,0.635; 5 -2.475,-0.635; 6 -2.475,-1.905; 7 -2.475,-3.175; 8 -2.475,-4.445; 9 2.475,-4.445; 10 2.475,-3.175; 11 2.475,-1.905; 12 2.475,-0.635; 13 2.475,0.635; 14 2.475,1.905; 15 2.475,3.175; 16 2.475,4.445
SPC4078 = drill 0.8 pad 2.184 long: 1 -3,0; 2 0,-4.8 | drill 1 pad 2.184 long: 3 3,0
HRO_TYPE-C-31-M-12 = smd 0.6 x 1.45: A1B12 -3.25,5.095; A4B9 -2.45,5.095; B1A12 3.25,5.095; B4A9 2.45,5.095 | smd 0.3 x 1.45: A5 -1.25,5.095; A6 -0.25,5.095; A7 0.25,5.095; A8 1.25,5.095; B5 1.75,5.095; B6 0.75,5.095; B7 -0.75,5.095; B8 -1.75,5.095 | drill 0.65 pad 1.05 long: S1 -4.32,4.18; S2 4.32,4.18; S3 -4.32,0; S4 4.32,0 | hole 0.7: -2.89,3.65; 2.89,3.65
2X03 = drill 1.016 pad 1.778 octagon: 1 -2.54,-1.27; 2 -2.54,1.27; 3 0,-1.27; 4 0,1.27; 5 2.54,-1.27; 6 2.54,1.27
1X06/90 = drill 1.016 pad 1.778 long: 1 -6.35,-3.81; 2 -3.81,-3.81; 3 -1.27,-3.81; 4 1.27,-3.81; 5 3.81,-3.81; 6 6.35,-3.81
1X12 = drill 1.016 pad 1.778 long: 1 -13.97,0; 2 -11.43,0; 3 -8.89,0; 4 -6.35,0; 5 -3.81,0; 6 -1.27,0; 7 1.27,0; 8 3.81,0; 9 6.35,0; 10 8.89,0; 11 11.43,0; 12 13.97,0
1X02/90 = drill 1.016 pad 1.778 long: 1 -1.27,-3.81; 2 1.27,-3.81
1X08 = drill 1.016 pad 1.778 long: 1 -8.89,0; 2 -6.35,0; 3 -3.81,0; 4 -1.27,0; 5 1.27,0; 6 3.81,0; 7 6.35,0; 8 8.89,0
L2012C = smd 1 x 1: 1 -1,0; 2 1,0
1X04 = drill 1.016 pad 1.778 long: 1 -3.81,0; 2 -1.27,0; 3 1.27,0; 4 3.81,0
R0402 = smd 0.6 x 0.7: 1 -0.5,0; 2 0.5,0
M0805 = smd 1.3 x 1.6: 1 -0.95,0; 2 0.95,0
TS-1187A-C-E-B = smd 1 x 0.75: A -3,1.875; B 3,1.875; C -3,-1.875; D 3,-1.875
SOIC8 = smd 0.6 x 1.5: 1 -1.905,-2.75; 2 -0.635,-2.75; 3 0.635,-2.75; 4 1.905,-2.75; 5 1.905,2.75; 6 0.635,2.75; 7 -0.635,2.75; 8 -1.905,2.75
CHIPLED_0805 = smd 1.2 x 1.2: A 0,-1.05; C 0,1.05
TF-115 = smd 0.7 x 1.6: 1 2.25,7; 2 1.15,7; 3 0.05,7; 4 -1.05,7; 5 -2.15,7; 6 -3.25,7; 7 -4.35,7; 8 -5.45,7; 9 -6.55,7 | smd 1.2 x 1.5: 10 -7.75,6 | smd 1.2 x 2.2: 11 -7.75,-3.6; 12 7.75,-3.6 | smd 1.6 x 1.5: 13 5.25,6 | hole 1: -4.95,-4; 3.05,-4
TQFP32-08 = smd 1.27 x 0.559: 1 -4.293,2.8; 2 -4.293,2; 3 -4.293,1.2; 4 -4.293,0.4; 5 -4.293,-0.4; 6 -4.293,-1.2; 7 -4.293,-2; 8 -4.293,-2.8; 17 4.293,-2.8; 18 4.293,-2; 19 4.293,-1.2; 20 4.293,-0.4; 21 4.293,0.4; 22 4.293,1.2; 23 4.293,2; 24 4.293,2.8 | smd 0.559 x 1.27: 9 -2.8,-4.293; 10 -2,-4.293; 11 -1.2,-4.293; 12 -0.4,-4.293; 13 0.4,-4.293; 14 1.2,-4.293; 15 2,-4.293; 16 2.8,-4.293; 25 2.8,4.293; 26 2,4.293; 27 1.2,4.293; 28 0.4,4.293; 29 -0.4,4.293; 30 -1.2,4.293; 31 -2,4.293; 32 -2.8,4.293
DPAK = smd 1.6 x 3: 1 -2.3,-6.65; 3 2.3,-6.65 | smd 6.7 x 6.7: 2 0,0
TO263-3 = smd 1.067 x 2.159: 1 -2.54,-5.791; 2 0,-5.791; 3 2.54,-5.791 | smd 10.8 x 10.41: TAB 0,2.54

### Placement (x,y rotation side)
3V3  47.24,46.96 180 top
5V  23.49,37.82 90 top
ARD_UART  44.32,73.63 0 top
AS7262  18.28,5.18 180 top
BT1  41.65,34.01 270 bottom
C1  23.36,47.98 0 top
C2  53.59,60.8 180 top
C4  34.16,29.94 270 top
C5  26.16,68.42 270 top
C6  26.28,72.61 90 top
C7  34.67,74.14 0 top
C8  25.01,72.61 270 top
C9  34.67,73 180 top
C10  36.57,34.01 180 top
C11  39.62,29.94 270 top
C12  25.01,62.58 270 top
C13  18.03,37.94 90 top
C14  14.6,32.48 180 top
C15  16.38,37.94 90 top
C16  36.57,43.79 180 top
C17  41.65,56.23 180 top
C18  42.03,58.39 90 top
C19  56.51,53.31 180 top
C20  56.76,60.8 0 top
C21  20.32,37.82 180 top
D2  27.05,35.15 270 top
D5  31.36,35.15 270 top
G1  56.38,57.12 90 top
G2  36.7,30.58 180 top
I2C_EXT  26.67,24.23 180 top
IC1  29.59,67.92 270 top
IC2  15.62,67.28 180 top
IC3  30.73,56.74 0 top
IC4  39.49,67.92 90 top
J1  55.88,45.56 180 top
J2  29.33,80.87 180 top
JP1  48.89,67.53 180 top
JP2  14.98,82.52 0 top
JP3  60.32,66.9 90 top
JP5  54.48,82.52 0 top
JP6  47.11,82.52 0 top
JP7  2.41,61.82 90 top
L2  41.02,60.93 0 top
LDS_CTRL  5.58,27.28 90 top
LDS_DAT  5.58,13.94 90 top
LED  53.72,73.5 270 top
MAX4466  58.16,6.19 270 top
MIX8410  5.71,4.16 0 top
R1  50.67,50.9 180 top
R2  35.68,54.84 0 top
R3  40.13,63.09 270 top
R4  27.55,73.25 270 top
R5  30.6,73.25 270 top
R6  5.84,59.79 180 top
R7  45.72,50.52 180 top
R8  50.67,49.76 0 top
R9  6.35,66.27 90 top
R10  25.78,57.38 180 top
R11  45.46,46.83 270 top
R12  37.59,72.74 90 top
R13  5.84,61.69 180 top
R15  6.35,68.81 90 top
R16  6.35,71.34 270 top
R17  21.84,36.04 180 top
R18  53.84,71.85 180 top
R20  25.52,64.87 0 top
R21  45.84,71.85 180 top
R22  45.84,70.71 180 top
R29  18.03,44.17 90 top
R30  18.03,47.47 270 top
RESET  39.49,78.33 0 top
RTC1  37.33,25.5 270 top
SCD30  31.62,5.18 180 top
SD  18.03,41.5 180 top
SJ1  54.86,64.74 0 top
SJ2  54.86,67.28 0 top
SJ3  54.86,69.82 0 top
TF115  7.74,42.64 270 top
TSL2591  44.95,5.18 180 top
U1  48.76,56.49 180 top
VOC_AE  58.16,19.66 270 top
VOC_DAT  58.16,33.12 270 top
VR1  28.82,42.9 270 top
VR2  42.92,38.71 270 top

### Tracks (layer width: path | path; a pad name or v marks a point on that pad's centre or on a via)
+3V3  (via drill 0.35)
  Top 0.305: 52.14,57.28 52.14,56.49 52.56,56.07 53.04,56.07 U1.4 53.81,56.1 54.5,55.41 54.5,52.76 51.49,49.76 R8.2 | 52.14,57.28 52.56,57.7 53.04,57.7 U1.6 | R9.1 5.33,64.75 5.33,64.36 | R8.2 R1.1 | C2.2 52.14,60.01 52.14,57.28 | R7.2 43.87,49.19 v43.87,47.34 43.87,46.84 44.83,45.88 R11.2 | R8.2 v51.17,45.83 v51.18,45.82 | R3.2 40.13,61.04 L2.1 | R2.2 36.18,57.81 36.65,58.28 36.65,59.9 35.29,61.26 | 35.29,61.26 33.28,61.26 IC3.16 | R10.2 25.7,57.8 25.7,60.52 28.65,63.47 | 35.29,61.26 33.27,63.28 33.27,63.47
  Top 0.381: IC4.16 35.05,71.27 v35.68,71.85 37.02,73.24 R12.2
  Top 0.508: TF115.4 16.67,43.69 17.65,44.67 R29.2
  Top 0.762: 33.2,46.2 33.2,40.36 34.85,38.71 VR2.2 VR2.TAB | 33.2,46.2 33.2,47.47 30.66,50.02 22.28,50.02 | C16.+ 34.95,44.46 33.2,46.2 | 5.33,63.09 5.33,64.36 5.33,67.29 R15.1 | 5.33,63.09 5.33,62.32 3.56,60.55 JP7.4 2.73,60.55 11.78,51.5 20.8,51.5 22.28,50.02 | 44.32,6.32 34.54,6.32 | 44.32,6.32 45.95,7.96 TSL2591.P2 45.95,12.03 44.23,13.76 44.23,17.11 48.86,21.75 48.86,28.18 45.46,31.58 VR2.TAB | 34.54,6.32 27.43,6.32 | 27.43,6.32 21.84,6.32 | 21.84,6.32 19.28,8.88 AS7262.P2 | 21.84,6.32 12.13,6.32 10.73,7.72 5.84,7.72 4.44,6.32 MIX8410.2 | MAX4466.P2 53.14,6.32 44.32,6.32 | SCD30.P2 32.62,8.24 34.54,6.32 | I2C_EXT.P2 27.67,28.25 25.43,26.01 25.43,8.32 27.43,6.32 | VR2.TAB 50.05,34.12 VOC_DAT.P2 | VR2.TAB R11.2 | 22.28,50.02 22.24,50.02 19.25,47.03 18.09,47.03 R30.2 R29.2 | R12.2 v41.4,73.24 43.17,73.24 ARD_UART.1 | C12.1 26.03,63.23 27.03,64.23 v27.05,64.23 | R20.2 26.41,64.87 v27.05,64.23 | v27.05,64.23 27.81,63.47 28.65,63.47 33.27,63.47 37.48,63.47 L2.1 | v19.82,71.34 22.22,73.75 IC2.VCC | 5.33,63.09 5.34,63.08 R13.2 R6.2
  Bottom 0.305: v51.18,45.82 44.89,45.82 43.87,46.83 v43.87,47.34
  Bottom 0.762: JP1.1 v51.43,71.47 49.66,73.24 v41.4,73.24 | v35.68,71.85 35.68,69.44 34.29,68.17 22.86,68.17 22.63,68.44 | v27.05,64.23 19.69,71.88 22.63,68.44 | 22.63,68.44 20.18,70.98 v19.82,71.34 9.39,71.34 5.33,67.28 5.33,62.33 3.55,60.55 JP7.4
+5V  (via drill 0.35)
  Top 0.762: VR1.3 20.97,40.29 C21.1 20.97,36.12 R17.2 20.64,35.78 v15.62,35.78 16.38,36.55 C15.1 17.83,37.09 C13.1 | LDS_CTRL.P2 9.75,26.26 v12.44,26.26 12.44,31.7 C14.+ | LDS_DAT.P2 9.76,12.97 12.44,12.97 v12.44,13.05
  Bottom 0.762: v15.62,35.78 15.49,35.66 15.47,35.66 12.44,32.63 v12.44,26.26 v12.44,13.05
A0  (via drill 0.35)
  Top 0.305: U1.23 43.72,54.5 43.3,54.08 43.3,54.07 40.51,51.28 v36.7,51.28
  Route2 0.305: v36.7,51.28 13.2,51.28 7.36,57.12 7.36,66.65 3.3,70.71 JP7.8
A1  (via drill 0.35)
  Top 0.305: U1.24 43.94,53.69 43.8,53.69 40.64,50.52 v36.19,50.52
  Route2 0.305: JP7.7 3.3,68.17 6.6,64.87 6.6,56.61 12.7,50.52 v36.19,50.52
A2  (via drill 0.35)
  Top 0.305: U1.25 45.84,52.07 43.2,52.07 40.89,49.76 v36.7,49.76 | v55.62,5.18 54.03,5.18 MAX4466.P3
  Route2 0.305: JP7.6 3.17,65.63 5.84,62.96 5.84,56.23 12.31,49.76 v36.7,49.76
  Route15 0.305: v36.7,49.76 36.93,49.52 36.93,14.43 39.45,11.91 53.97,11.91 55.62,10.26 v55.62,5.18
A3  (via drill 0.35)
  Top 0.305: U1.26 46.76,51.56 46.48,51.28 43.43,51.28 42.59,50.47 41.09,48.99 v36.19,48.99
  Route2 0.305: v36.19,48.99 12.7,48.99 | 12.7,48.99 11.93,48.99 5.08,55.85 5.08,61.19 3.17,63.09 JP7.5 | 12.7,48.99 6.09,42.39 6.09,5.05 MIX8410.3
A6  (via drill 0.35)
  Top 0.305: U1.19 43.37,57.69 v43.3,57.76
  Route15 0.305: JP5.1 53.21,75.41 52.5,74.7 45.28,74.7 43.3,72.72 v43.3,57.76
A7  (via drill 0.35)
  Top 0.305: v43.28,55.39 43.39,55.29 U1.22
  Route15 0.305: v43.28,55.39 43.96,56.06 43.96,72.38 45.59,74.01 53.08,74.01 55.75,76.68 JP5.2
AREF
  Top 0.381: U1.20 42.96,56.89 C17.1
AT_RXI  (via drill 0.35)
  Top 0.305: v36.83,68.93 37.08,68.93 37.59,69.44 IC4.14 R12.1 | U1.30 49.91,52.19 49.91,53.44 v49.78,53.56 | IC3.3 v29.71,58.64
  Route2 0.305: v36.83,62.58 36.83,56.11 39.11,53.82 49.53,53.82 v49.78,53.56
  Route15 0.305: v36.83,68.93 v36.83,62.58 31.11,62.58 30.48,61.95 30.48,59.41 v29.71,58.64
AT_TXO  (via drill 0.35)
  Top 0.305: v40.13,66.9 IC4.5 R3.1 | v50.67,53.56 50.8,53.44 50.8,52.23 U1.31 | IC3.13 v31.75,57.38
  Route2 0.305: v50.67,53.56 50.67,54.2 50.29,54.58 39.62,54.58 37.59,56.61 v37.59,61.82
  Route15 0.305: v40.13,66.9 37.59,64.36 v37.59,61.82 31.62,61.82 31.11,61.31 31.11,58.01 v31.75,57.38
AVCC
  Top 0.381: C18.2 42.59,58.49 U1.18
  Top 0.508: C18.2 42.03,60.91 L2.2
CD  (via drill 0.35)
  Top 0.305: TF115.9 16.81,49.19 R30.1 18.29,48.23 v19.05,48.23 | U1.11 49.95,60.79 49.95,61.48 v50.92,62.45
  Route2 0.305: v50.92,62.45 52.7,60.68 52.7,53.69 47.24,48.23 42.81,48.23 42.2,48.84 41.1,48.84 40.49,48.23 v19.05,48.23
  Route15 0.305: v50.92,62.45 52.83,62.45 56,65.63 JP3.6
D2  (via drill 0.35)
  Top 0.305: U1.32 v51.56,53.56
  Route15 0.305: v51.56,53.56 52.19,52.93 JP3.1
D3  (via drill 0.35)
  Top 0.305: U1.1 52.45,53.69 51.68,54.45 v51.43,54.45
  Route15 0.305: JP3.2 52.45,55.47 v51.43,54.45
D4  (via drill 0.35)
  Top 0.305: U1.2 53.02,54.45 52.45,54.45 v51.43,55.47
  Route15 0.305: JP3.3 58.42,56.11 52.07,56.11 v51.43,55.47
DTR  (via drill 0.35)
  Top 0.305: R9.2 7.33,67.75 IC2.IO0 8.11,67.79 v10.03,67.79 | v32.63,69.44 32.61,69.42 IC1.28
  Route2 0.305: JP2.1 8.63,72.49 12.19,69.06 | 12.19,69.06 32.25,69.06 v32.63,69.44 | 12.19,69.06 10.92,67.79 v10.03,67.79
ESP_EN
  Top 0.305: R20.1 23.91,63.75 IC2.EN
ESP_RXI  (via drill 0.35)
  Top 0.305: v10.16,60.93 9.34,61.75 IC2.RXD/IO3 8.02,61.69 R13.1 | v41.4,68.93 40.95,68.93 40.13,69.76 IC4.12 | IC3.5 26.79,56.11 v26.67,55.98
  Route2 0.305: v41.4,68.93 41.02,68.93 39.37,67.28 37.33,67.28 37.08,67.53 12.7,67.53 10.16,65 v10.16,60.93 10.16,55.47 13.71,51.91 25.65,51.91 26.67,52.93 v26.67,55.98
ESP_TXO  (via drill 0.35)
  Top 0.305: v11.04,60.93 9.86,59.75 IC2.TXD/IO1 8.04,59.79 R6.1 | v34.16,66.35 35.05,65.46 IC4.1 | IC3.14 34.03,58.64 v34.92,59.53
  Route2 0.305: v34.16,66.35 33.61,66.9 13.08,66.9 10.92,64.74 10.92,61.06 v11.04,60.93 10.92,60.8 10.92,55.98 14.22,52.68 25.27,52.68 26.01,53.41 26.01,56.38 26.27,56.64 32.02,56.64 v34.92,59.53
GND  (via drill 0.35)
  Top 0.305: IC1.3 30.09,68.42 IC1.EXP | J2.S2 25.17,76.69 J2.B1A12 | R4.2 26.8,72.75 C6.2 | U1.3 52.55,55.29 51.43,56.4 v51.43,56.61
  pour Top: 0.01,83.5 63.51,83.5 63.51,0 0.01,0
  pour Bottom: 0.01,0 0.01,83.5 63.51,83.5 63.51,0
ISP-MI
  Top 0.305: U1.16 45.95,60.79 45.95,62.04 48.9,64.99 48.9,66.26 JP1.4 48.89,66.49 49.93,67.53 53.84,67.53 SJ2.1
ISP-MO
  Top 0.305: SJ1.1 52.57,66.27 JP1.2 51.18,66.27 46.76,61.97 U1.15
ISP-SC
  Top 0.305: U1.17 45.36,60.17 45.36,62.35 47.62,64.61 47.62,66.27 | JP1.6 47.62,66.27 | 47.62,66.27 47.62,69.44 48.26,70.08 53.84,70.08 SJ3.1
LDS_RST  (via drill 0.35)
  Top 0.305: v8.38,32.1 10.03,32.1 10.92,31.21 10.92,28.87 10.32,28.28 LDS_CTRL.P3 | v51.56,63.22 50.8,63.22 49.21,61.63 49.21,60.82 U1.12
  Route2 0.305: JP3.7 61.72,68.17 62.38,67.51 62.38,44.42 60.85,42.9 10.16,42.9 8.38,41.12 v8.38,32.1
  Route15 0.305: v51.56,63.22 52.79,63.22 57.74,68.17 JP3.7
LDS_RXI  (via drill 0.35)
  Top 0.305: R10.1 IC3.4 v29.71,57.38 | v6.85,14.96 9.72,14.96 LDS_DAT.P3
  Route2 0.305: v29.71,47.47 12.31,47.47 6.85,42.01 v6.85,14.96
  Route15 0.305: v29.71,57.38 v29.71,47.47
LDS_SET  (via drill 0.35)
  Top 0.305: v9.77,31.34 9.73,31.3 LDS_CTRL.P4 | v52.19,63.98 50.67,63.98 48.36,61.67 U1.13
  Route2 0.305: v9.77,31.34 9.14,31.98 9.14,40.61 10.66,42.13 61.21,42.13 62.99,43.92 62.99,69.31 61.59,70.71 JP3.8
  Route15 0.305: v52.19,63.98 52.45,63.98 59.18,70.71 JP3.8
LDS_TXO  (via drill 0.35)
  Top 0.305: R2.1 IC3.11 v31.75,54.84 | v7.62,16.99 9.69,16.99 LDS_DAT.P4
  Route2 0.305: v31.75,46.71 12.7,46.71 7.62,41.63 v7.62,16.99
  Route15 0.305: v31.75,54.84 v31.75,46.71
MISO  (via drill 0.35)
  Top 0.305: v57.53,67.03 57.15,67.03 56.89,67.28 SJ2.2 | TF115.7 13.35,46.99 12.19,45.84 v12.19,44.42
  Route2 0.305: JP3.11 59.3,78.33 57.53,76.42 v57.53,67.03 57.53,55.86 45.97,44.42 v12.19,44.42
MOSI  (via drill 0.35)
  Top 0.305: TF115.3 13.98,42.59 13.08,43.5 v13.08,43.66 | v58.29,64.49 55.88,64.49 SJ1.2
  Route2 0.305: v13.08,43.66 46.22,43.66 58.29,55.72 v58.29,64.49 58.29,74.77 59.3,75.79 JP3.10
N$1
  Top 0.305: C4.1 35.93,30.59 G2.2 35.95,28.26 35.09,27.4 RTC1.1
N$2
  Top 0.305: U1.7 53.75,58.49 56.38,55.85 G1.P$1 57.16,54.49 C19.1
N$3
  Top 0.381: BT1.VDD 42.67,20.71 42.67,26.26 41.52,27.4 RTC1.8
  Top 0.762: BT1.VDD1 BT1.VDD
N$4
  Top 0.305: 3V3.A 47.17,47.78 R11.1
N$5
  Top 0.305: IC2.IO2 7.06,69.75 6.61,69.31 R15.2
N$6
  Top 0.305: C11.1 39.6,30.58 G2.1 37.45,28.44 35.14,26.13 RTC1.2
N$7
  Top 0.762: D2.C 26.77,37.17 24.66,39.28 24.66,42.71 VR1.1 22.41,45.2 C1.1
N$8
  Top 0.305: R18.2 52.89,73.43 LED.A
N$9
  Top 0.305: U1.8 56.07,59.29 G1.P$2 56.11,59.24 C20.1
N$10
  Top 0.305: R4.1 27.58,73.78 J2.B5
N$11
  Top 0.305: J2.A5 30.6,75.75 R5.1
N$12
  Top 0.305: IC4.10 42.67,71.09 43.43,71.85 R21.2 45.34,73.37 ARD_UART.2
N$13
  Top 0.305: R22.2 44.2,70.71 43.94,70.45 IC4.9
N$14
  Top 0.305: IC2.IO15 7.16,70.84 R16.2
N$15
  Top 0.305: 5V.A 24.24,37.49 R17.1
N$16
  Top 0.305: C5.1 26.16,71.84 C6.1 27.69,71.97 28.52,71.14 28.52,70.28 IC1.6
N$19
  Top 1.016: D5.C 32.55,36.17 33.78,36.17 | VR2.3 33.78,36.17 | C10.+ 35.2,34.75 33.78,36.17
N$20
  Top 0.305: R29.1 SD.A
RESET  (via drill 0.35)
  Top 0.305: C9.1 35.37,73 36.49,74.12 RESET.C v38.22,76.45 RESET.D 48.1,76.45 48.9,75.66 48.91,72.25 v48.89,72.23 | v21.59,68.3 21.59,61.24 IC2.RST | R1.2 49.53,50.9 49.16,51.27 U1.29 49.16,59.49 v49.14,59.51
  Route2 0.305: v21.59,68.3 12.57,68.3 9.27,65 9.27,59.15 v8.12,58.01
  Route15 0.305: JP7.3 v8.12,58.01 | v49.14,59.51 v49.14,59.52 49.14,62.84 50.08,63.77 50.08,67.67 48.95,68.81 JP1.3 v48.89,72.23 | v38.22,76.45 35.97,78.71 24.76,78.71 21.59,75.54 v21.59,68.3
RTS  (via drill 0.35)
  Top 0.305: IC1.24 31.95,67.36 32.51,67.36 32.76,67.1 v32.76,66.14 | v32.89,72.23 33.25,72.23 C9.2
  Route2 0.305: JP2.4 16.25,77.06 17.63,75.69 30.96,75.69 31.47,75.18 31.47,72.51 31.75,72.23 v32.89,72.23
  Route15 0.305: v32.76,66.14 31.87,67.03 31.87,71.34 32.76,72.23 v32.89,72.23
RXI  (via drill 0.35)
  Top 0.305: IC1.26 33.01,68.42 33.22,68.63 33.22,70.57 32.7,71.09 v32.63,71.09 | v38.86,68.93 IC4.13
  Route2 0.305: JP2.3 13.71,71.09 14.22,70.58 31.62,70.58 32.13,71.09 v32.63,71.09 33.14,71.09 33.65,70.58 36.19,70.58 37.88,68.93 v38.86,68.93
SCK  (via drill 0.35)
  Top 0.305: v56.76,69.57 55.88,69.57 SJ3.2 55.3,70.14 55.3,71.34 R18.1 | TF115.5 13.47,44.79 v13.08,45.18
  Route2 0.305: JP3.12 59.05,80.87 56.76,78.58 v56.76,69.57 56.76,56.11 46.1,45.18 v13.08,45.18
SCL  (via drill 0.35)
  Top 0.305: v41.65,7.84 41.65,9.03 TSL2591.P4 40.05,9.33 37.4,11.98 37.4,23.71 38.55,24.86 RTC1.6 41.14,24.86 v41.4,24.61 | v29.08,7.84 28.62,8.3 SCD30.P4 | v15.87,7.84 15.28,8.43 AS7262.P4 18.65,12.69 22.87,12.69 23.67,13.48 I2C_EXT.P4 | VOC_DAT.P4 51.99,30.12 v51.94,30.07 | 50.14,49.76 v50.14,44.93 | R8.1 50.14,49.76 | 50.14,49.76 49.51,49.76 v48.51,50.77 48.36,50.9 U1.28
  Route2 0.305: v41.65,7.84 41.65,5.3 41.27,4.92 29.71,4.92 | 29.71,4.92 29.08,5.56 v29.08,7.84 | 29.71,4.92 17.01,4.92 15.87,6.07 v15.87,7.84
  Route15 0.305: 45.42,31.13 41.4,27.11 v41.4,24.61 | 45.42,31.13 50.14,35.85 v50.14,44.93 | v51.94,30.07 46.48,30.07 45.42,31.13 | v48.51,50.77 48.51,50.26 47.24,48.99 43.56,48.99 41.78,50.77 41.78,58.26 42.16,58.64 42.16,73.38 45.84,77.06 JP6.1
SD_CS  (via drill 0.35)
  Top 0.305: TF115.2 16.99,41.49 SD.C 19.17,41.59 v19.17,45.95 | v51.56,64.74 51.46,64.84 50.61,64.84 47.56,61.8 U1.14
  Route2 0.305: v19.17,45.95 45.82,45.95 55.88,56 55.88,68.55 | v55.88,72.11 55.88,68.55 | 55.88,68.55 52.07,64.74 v51.56,64.74
  Route15 0.305: JP3.9 57.27,73.25 v55.88,72.11
SDA  (via drill 0.35)
  Top 0.305: R7.1 47.24,50.52 v47.49,50.77 | v47.49,50.77 47.56,50.84 U1.27 | v43.56,7.84 43.95,8.24 TSL2591.P3 42.32,10.96 39.43,10.96 38.12,12.27 38.12,22.8 38.91,23.59 RTC1.5 41.02,23.59 v41.4,23.21 | SCD30.P3 30.98,8.96 v30.98,7.84 | v17.78,7.84 17.28,8.34 AS7262.P3 17.28,10.09 19.1,11.91 23.24,11.91 24.39,13.06 24.39,27.18 25.59,28.38 I2C_EXT.P3 | VOC_DAT.P3 52.84,32.12 v51.81,31.09 | v47.49,50.77 49.14,49.12 v49.14,44.93
  Route2 0.305: v44.19,31.09 v51.81,31.09 | v17.78,7.84 17.78,9.88 18.92,11.02 30.35,11.02 | 30.35,11.02 30.98,10.39 v30.98,7.84 | 30.35,11.02 42.79,11.02 43.56,10.26 v43.56,7.84
  Route15 0.305: v49.14,44.93 49.14,36.04 v44.19,31.09 40.64,27.53 40.64,23.97 v41.4,23.21 | v47.49,50.77 46.48,49.76 43.94,49.76 42.54,51.15 42.54,58.14 42.75,58.34 42.75,73.08 JP6.2
TXO  (via drill 0.35)
  Top 0.305: v37.59,68.17 IC4.3 | IC1.25 33.32,67.92 33.68,68.27 33.68,69.21 v33.9,69.44
  Route2 0.305: JP2.2 11.17,71.31 12.68,69.82 31.75,69.82 32.13,70.2 33.14,70.2 v33.9,69.44 35.17,68.17 v37.59,68.17
U_SEL_A  (via drill 0.35)
  Top 0.305: v50.67,59.53 50.8,59.66 50.8,60.75 U1.10 50.75,60.79 50.75,61.38 51.95,62.58 59.81,62.58 JP3.5 | v39.75,56.99 39.39,56.99 35.96,53.56 IC3.10
  Route2 0.305: v50.67,59.53 48.13,56.99 v39.75,56.99
U_SEL_B  (via drill 0.35)
  Top 0.305: v51.56,59.53 v51.56,59.54 U1.9 51.56,61.29 52.2,61.92 58.95,61.92 JP3.4 | v39.37,56.11 v39.36,56.11 35.55,52.3 IC3.9
  Route2 0.305: v51.56,59.53 51.33,59.3 51.33,59.26 48.17,56.11 v39.37,56.11
USBD+  (via drill 0.35)
  Top 0.305: J2.A6 29.58,74.77 29.71,74.65 v29.71,74.52 29.71,74.39 29.58,74.27 IC1.4 | J2.B6 28.58,74.66 v28.44,74.52
  Bottom 0.305: v28.44,74.52 v29.71,74.52
USBD-
  Top 0.305: J2.B7 30.08,76.55 29.85,76.78 29.32,76.78 29.08,76.55 J2.A7 IC1.5
VIN  (via drill 0.35)
  Top 1.016: D5.A D2.A 25.9,34.09 10.54,34.09 v10.54,34.13
  Bottom 1.016: 6.22,41.5 6.22,51.28 4.57,52.93 JP7.1 | 6.22,41.5 6.22,38.45 v10.54,34.13 | J1.3 52.88,41.75 50.08,38.96 8.76,38.96 6.22,41.5
XUSB  (via drill 0.35)
  Top 0.305: IC1.7 27.69,69.82 | 27.69,69.82 IC1.8 | C7.1 32.54,74.14 31.75,74.93 31.75,75.74 J2.A4B9 31.77,75.79 31.77,76.36 30.43,77.69 v29.33,77.69 28.23,77.69 26.9,76.36 26.9,75.79 J2.B4A9 26.88,75.16 25.01,73.29 C8.1 | v27.3,71.34 27.3,70.33 27.69,69.95 27.69,69.82
  Bottom 0.305: v27.3,71.34 27.3,74.27 29.33,76.3 v29.33,77.69

### Text on the board
tNames: ISP-DIS
bNames: GND / GND / RTS / RXI / TXO / DTR | SCL / SDA | A7 / A6 | 3v3 / RST / GND | MOSI / MISO / SCK | A0 / A1 / A2 / A3 / 3v3 / RST / GND / VIN | SS / D9 / D8 / D7 / D6 / D5 / D4 / D3 / D2 | NC / O2 / 3v3 / GND
Document: Design rule: / 0402 package gets size 24, no value